# Altium schematic sheet IMU_BLOCK.SchDoc
size A
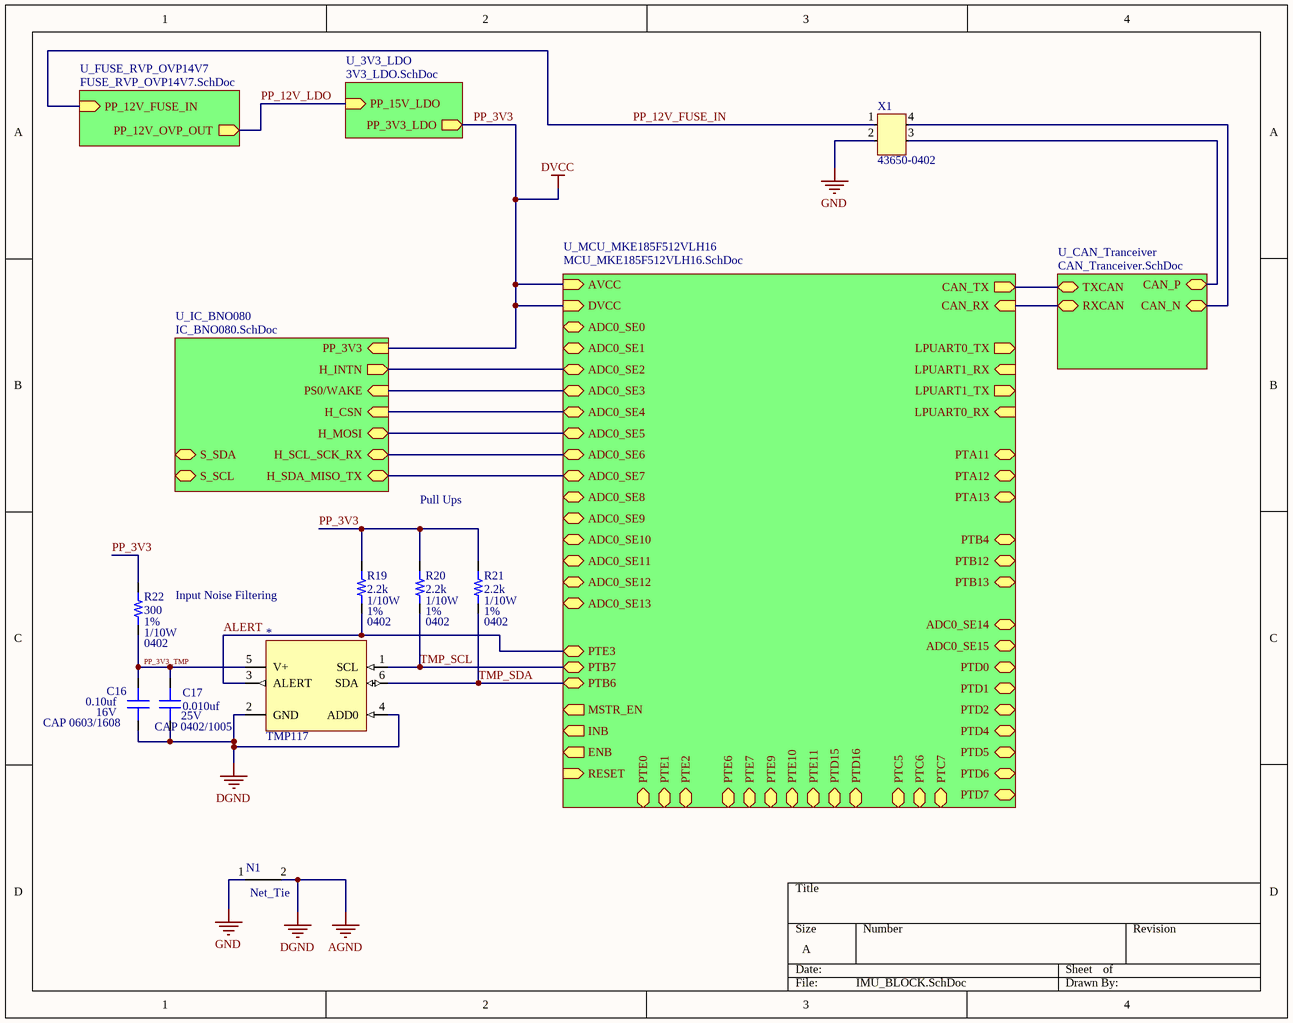
[diagram p0: IMU_BLOCK.SchDoc]

## Parts
*  TMP117  [WSON-6]
C16  value 0.10uf  Voltage_Rating: 16V  [CAP 0603/1608]  (hidden comment: Capacitor MLCC 0.10uf 16V CAP 0603/1608)
C17  value 0.010uf  Voltage_Rating: 25V  [CAP 0402/1005]  (hidden comment: Capacitor MLCC 0.010uf 25V CAP 0402/1005)
N1  Net_Tie  [Net_Tie]
R19  value 2.2k  Tolerance: 1%  Power: 1/10W  Package: 0402  [RES 0402/1005]  (hidden comment: Resistor 2.2k 0402 1/10W 1%)
R20  value 2.2k  Tolerance: 1%  Power: 1/10W  Package: 0402  [RES 0402/1005]  (hidden comment: Resistor 2.2k 0402 1/10W 1%)
R21  value 2.2k  Tolerance: 1%  Power: 1/10W  Package: 0402  [RES 0402/1005]  (hidden comment: Resistor 2.2k 0402 1/10W 1%)
R22  value 300  Tolerance: 1%  Power: 1/10W  Package: 0402  [RES 0402/1005]  (hidden comment: Resistor 300 0402 1/10W 1%)
X1  43650-0402  [Molex_43650_0402]

## Sub-sheets
U_3V3_LDO = 3V3_LDO.SchDoc: PP_3V3_LDO (out), PP_15V_LDO (in)
U_CAN_Tranceiver = CAN_Tranceiver.SchDoc: TXCAN (bidir), RXCAN (bidir), CAN_P (bidir), CAN_N (bidir)
U_FUSE_RVP_OVP14V7 = FUSE_RVP_OVP14V7.SchDoc: PP_12V_FUSE_IN (in), PP_12V_OVP_OUT (out)
U_IC_BNO080 = IC_BNO080.SchDoc: PP_3V3 (in), PS0/WAKE (in), H_SDA_MISO_TX (bidir), H_SCL_SCK_RX (bidir), H_CSN (in), H_MOSI (bidir), S_SDA (bidir), H_INTN (out), S_SCL (bidir)
U_MCU_MKE185F512VLH16 = MCU_MKE185F512VLH16.SchDoc: CAN_TX (out), CAN_RX (in), INB (out), ENB (out), ADC0_SE11 (bidir), ADC0_SE10 (bidir), ADC0_SE9 (bidir), ADC0_SE8 (bidir), ADC0_SE15 (bidir), ADC0_SE14 (bidir), ADC0_SE13 (bidir), ADC0_SE12 (bidir), ADC0_SE7 (bidir), ADC0_SE6 (bidir), ADC0_SE1 (bidir), ADC0_SE0 (bidir), LPUART0_TX (out), LPUART0_RX (in), MSTR_EN (out), ADC0_SE5 (bidir), ADC0_SE4 (bidir), LPUART1_TX (out), LPUART1_RX (in), ADC0_SE3 (bidir), ADC0_SE2 (bidir), DVCC (in), AVCC (in), PTD5 (bidir), PTD6 (bidir), PTD7 (bidir), PTB4 (bidir), PTE9 (bidir), PTD15 (bidir), PTD16 (bidir), PTE3 (bidir), PTB6 (bidir), PTB7 (bidir), PTE10 (bidir), PTE11 (bidir), PTD0 (bidir), PTD1 (bidir), PTC7 (bidir), PTC6 (bidir), PTE6 (bidir), PTE2 (bidir), PTA13 (bidir), PTA12 (bidir), PTA11 (bidir), PTE1 (bidir), PTE0 (bidir), RESET (in), PTD2 (bidir), PTD4 (bidir), PTB13 (bidir), PTB12 (bidir), PTE7 (bidir), PTC5 (bidir)

## Nets
AGND: *.2(GND) *.4(ADD0) C16.1 C17.1 N1.2  [also labelled DGND]
GND: N1.1 X1.2
PP_3V3: R19.2 R20.2 R21.2 R22.2 ; sheet U_MCU_MKE185F512VLH16/DVCC, sheet U_MCU_MKE185F512VLH16/AVCC, sheet U_3V3_LDO/PP_3V3_LDO, sheet U_IC_BNO080/PP_3V3  [also labelled DVCC]
ALERT: *.3(ALERT) R19.1 ; sheet U_MCU_MKE185F512VLH16/PTE3
PP_3V3_TMP: *.5(V+) C16.2 C17.2 R22.1
PP_12V_FUSE_IN: X1.1 ; sheet U_FUSE_RVP_OVP14V7/PP_12V_FUSE_IN
PP_12V_LDO: sheet U_FUSE_RVP_OVP14V7/PP_12V_OVP_OUT, sheet U_3V3_LDO/PP_15V_LDO
TMP_SCL: *.1(SCL) R20.1 ; sheet U_MCU_MKE185F512VLH16/PTB7
TMP_SDA: *.6(SDA) R21.1 ; sheet U_MCU_MKE185F512VLH16/PTB6
NetX1_3: X1.3 ; sheet U_CAN_Tranceiver/CAN_P
NetX1_4: X1.4 ; sheet U_CAN_Tranceiver/CAN_N
(unnamed): sheet U_CAN_Tranceiver/TXCAN, sheet U_MCU_MKE185F512VLH16/CAN_TX
(unnamed): sheet U_CAN_Tranceiver/RXCAN, sheet U_MCU_MKE185F512VLH16/CAN_RX
(unnamed): sheet U_MCU_MKE185F512VLH16/ADC0_SE7, sheet U_IC_BNO080/H_SDA_MISO_TX
(unnamed): sheet U_MCU_MKE185F512VLH16/ADC0_SE6, sheet U_IC_BNO080/H_SCL_SCK_RX
(unnamed): sheet U_MCU_MKE185F512VLH16/ADC0_SE5, sheet U_IC_BNO080/H_MOSI
(unnamed): sheet U_MCU_MKE185F512VLH16/ADC0_SE4, sheet U_IC_BNO080/H_CSN
(unnamed): sheet U_MCU_MKE185F512VLH16/ADC0_SE3, sheet U_IC_BNO080/PS0/WAKE
(unnamed): sheet U_MCU_MKE185F512VLH16/ADC0_SE2, sheet U_IC_BNO080/H_INTN

## Notes on the sheet
- Pull Ups
- Input Noise Filtering

## Library data of the parts
* = 5: Temperature Sensor Digital, Local -55°C ~ 150°C 16 b 6-WSON (2x2); Manufacturer_id: 1; MfrPartNo: TMP117MAIDRVT; idADC: 5; Created_By: Non Wajanakunakorn; Drawer_id: 1; Package: WSON-6; Link: https://www.digikey.com/product-detail/en/texas-instruments/TMP117MAIDRVT/296-52215-1-ND/9749243
C16 = 223: Manufacturer_id: 1; idCapacitor: 223; Name: Cap_0.10uf_16V_CAP 0603/1608; Dielectric: Ceramic; Created_By: Nick Mah; Drawer_id: 1; Package: CAP 0603/1608; Created_Date: 10/20/2018
C17 = 457: Manufacturer_id: 1; idCapacitor: 457; Name: Cap_0.010uf_25V_CAP 0402/1005; Dielectric: Ceramic; Created_By: Nick Mah; Drawer_id: 1; Package: CAP 0402/1005; Created_Date: 10/20/2018
N1 = 1: Manufacturer_id: 1; idFuse: 3; Name: Net Tie; Drawer_id: 1; idShunt: 1
R19-R21 = 81: Manufacturer_id: 1; idResistor: 81; Name: Res_2.2k_0402_1/10W_1%; Created_By: Nick Mah; Supplier 1: Digi-Key; Drawer_id: 1; ComponentLink1Description: Datasheet; Created_Date: 2018-10-20
R22 = 60: Manufacturer_id: 1; idResistor: 60; Name: Res_300_0402_1/10W_1%; Created_By: Nick Mah; Supplier 1: Digi-Key; Drawer_id: 1; ComponentLink1Description: Datasheet; Created_Date: 2018-10-20
X1 = 6: Manufacturer_id: 4; idConn: 6; Drawer_id: 1; Name: Molex 43650_0402; Value: CONN; Voltage_Rating: 600V; Pitch: 3mm; Created_By: Nick; MfrPartNo: 43650-0402; Num_Contacts: 4; Num_Rows: 1; Package: Conn; Link: https://www.digikey.com/product-detail/en/molex-llc/0436500402/WM11252-ND/3310554; ComponentLink1Description: Datasheet; ComponentLink1URL: https://www.mouser.com/datasheet/2/276/0436500402_PCB_HEADERS-148886.pdf; Supplier1: Digi-Key; Supplier1PartNo: WM11252-ND